# EAGLE design MinipHV2_1 (EAGLE 6.3)
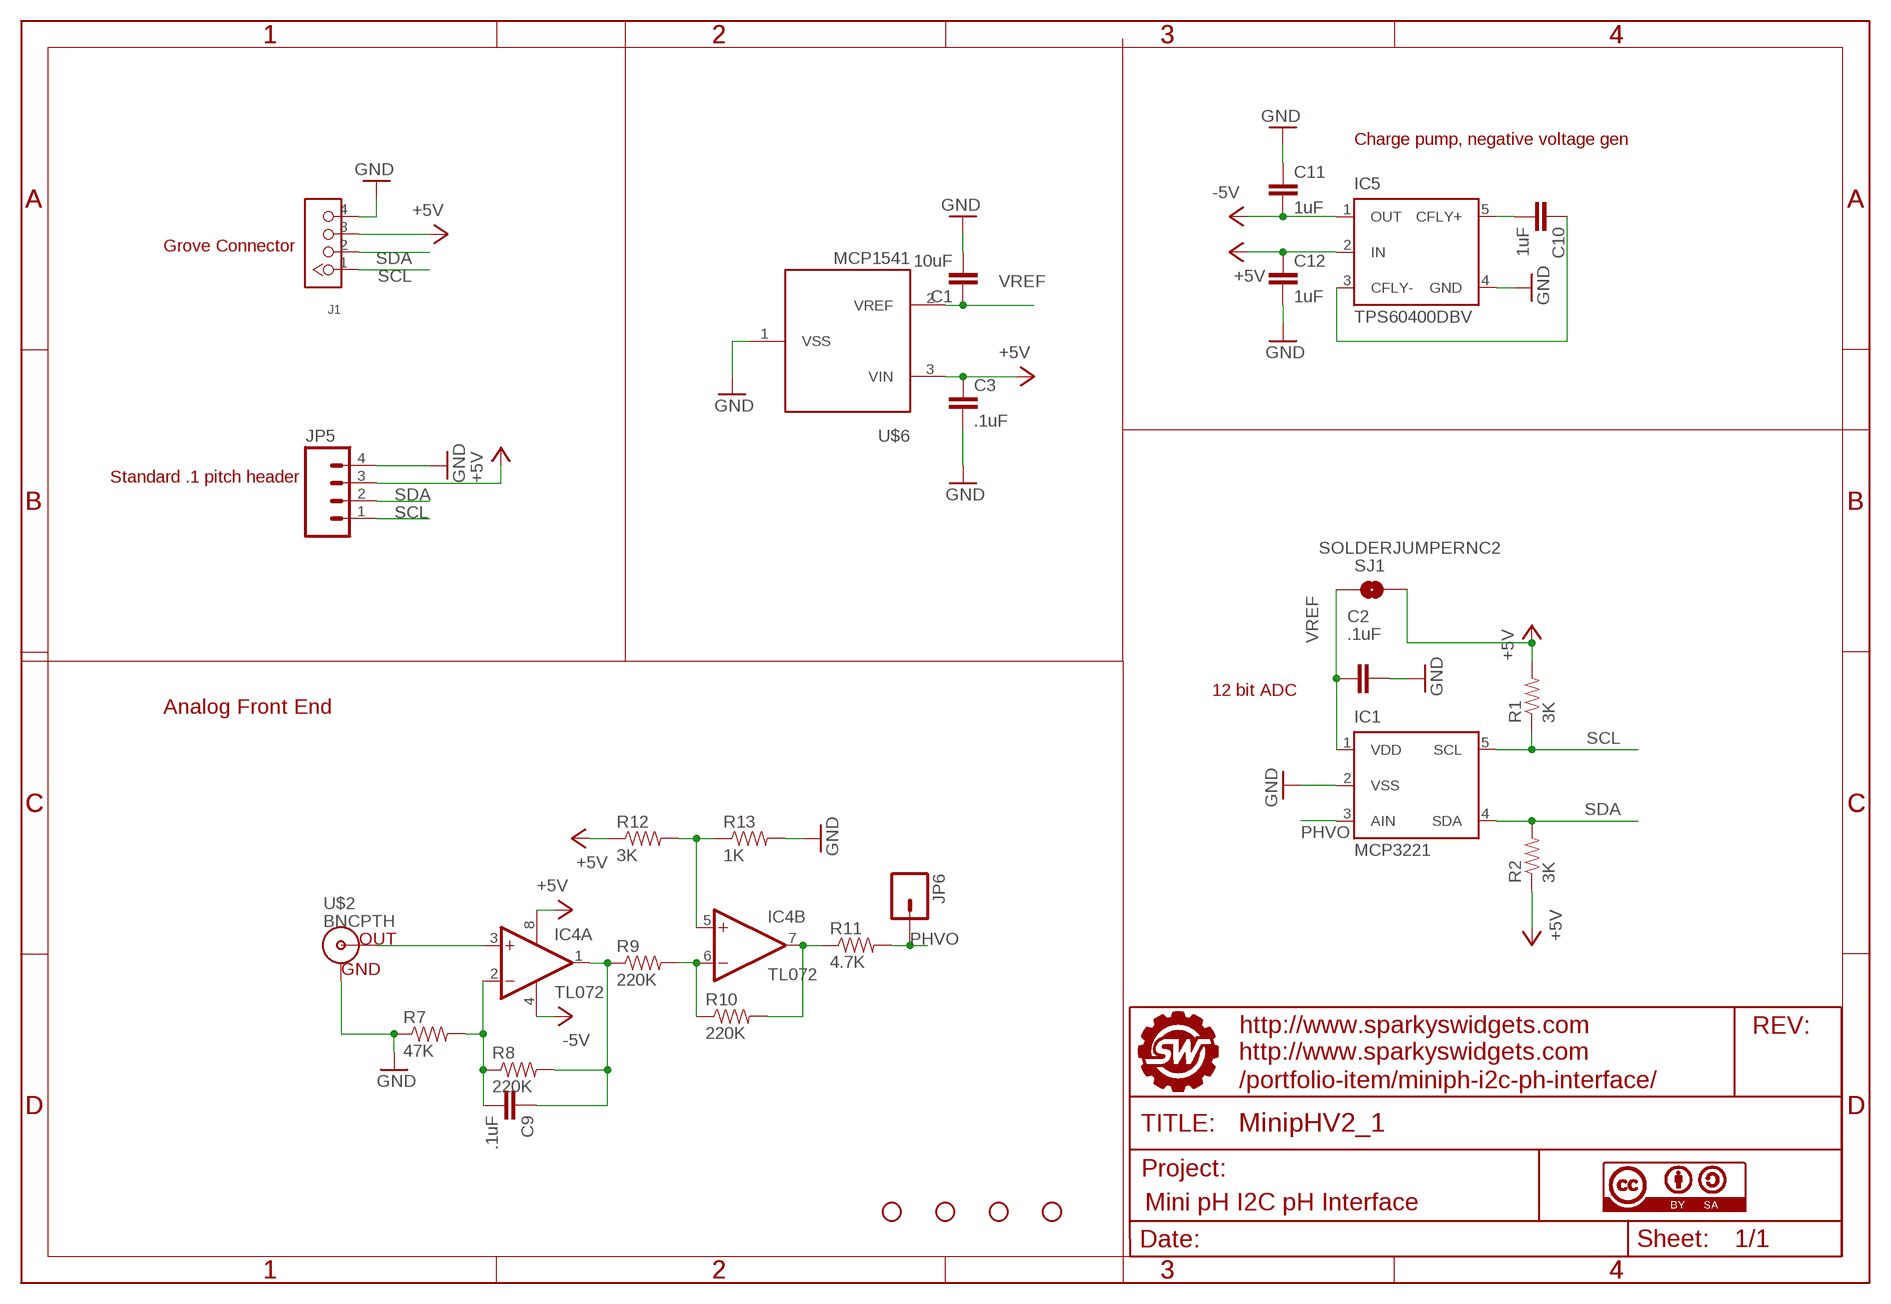
[diagram p0: schematic, sheet 1]

## Parts
C1  10uF  CAP0805  [0805]
C2  .1uF  CAP0805  [0805]
C3  .1uF  CAP0805  [0805]
C9  .1uF  CAP0805  [0805]
C10  1uF  CAP0805  [0805]
C11  1uF  CAP0805  [0805]
C12  1uF  CAP0805  [0805]
IC1  MCP3221  [SOT23-DBV]
IC4  TL072  LM358D  [SO08]
IC5  TPS60400DBV  [SOT23-DBV]
J1  TWIG-4P-2.0-2.0  [4P-2.0]
JP1  STAND-OFF  [STAND-OFF]
JP2  STAND-OFF  [STAND-OFF]
JP3  STAND-OFF  [STAND-OFF]
JP4  STAND-OFF  [STAND-OFF]
JP5  M04PTH  [1X04]
JP6  M01PTH_LONGPAD  [1X01_LONGPAD]
R1  3K  RESISTOR0805-RES  [0805]
R2  3K  RESISTOR0805-RES  [0805]
R7  47K  RESISTOR0805-RES  [0805]
R8  220K  RESISTOR0805-RES  [0805]
R9  220K  RESISTOR0805-RES  [0805]
R10  220K  RESISTOR0805-RES  [0805]
R11  4.7K  RESISTOR0805-RES  [0805]
R12  3K  RESISTOR0805-RES  [0805]
R13  1K  RESISTOR0805-RES  [0805]
SJ1  SOLDERJUMPERNC2  [SJ_2S-NOTRACE]
U$2  BNCPTH  [BNC]
U$4  FRAME_MINIPH  [SWPCBLOGOWITHINFO]
U$5  CC-BY-SA  [CC-BY-SA]
U$6  MCP1541  [SOT-23]

## Nets
+5V: C3.1 C12.1 IC4.8(P:V+) IC5.2(IN) J1.3 JP5.3 R1.2 R2.1 R12.1 SJ1.2 U$6.3(VIN)
-5V: C11.2 IC4.4(P:V-) IC5.1(OUT)
GND: C1.2 C2.1 C3.2 C11.1 C12.2 IC1.2(VSS) IC5.4(GND) J1.4 JP5.4 R7.1 R13.2 U$2.GND U$6.1(VSS)
N$1: IC4.5(B:+IN) R12.2 R13.1
N$2: IC4.7(B:OUT) R10.2 R11.1
N$3: IC4.6(B:-IN) R9.2 R10.1
N$7: IC4.3(A:+IN) U$2.S(OUT)
N$9: C9.2 IC4.2(A:-IN) R7.2 R8.1
N$10: C9.1 IC4.1(A:OUT) R8.2 R9.1
N$22: C10.1 IC5.3(CFLY-)
N$23: C10.2 IC5.5(CFLY+)
PHVO: IC1.3(AIN) JP6.1 R11.2
SCL: IC1.5(SCL) J1.1 JP5.1 R1.1
SDA: IC1.4(SDA) J1.2 JP5.2 R2.2
VREF: C1.1 C2.2 IC1.1(VDD) SJ1.1 U$6.2(VREF)

## Notes on the sheet
- Charge pump, negative voltage gen
- Grove Connector
- Standard .1 pitch header
- 12 bit ADC
- Analog Front End

## Library data of the parts
C1-C3 C9-C12 = SparkysWidgets:CAP: Capacitor Standard 0603 ceramic capacitor, and 0.1" leaded capacitor.
IC1 = SparkysWidgets:MCP3221: 12 bit I2C ADC Low power 12-bit I2c ADC from MicroChip upto 22.3KSPS Source: http://ww1.microchip.com/downloads/en/DeviceDoc/21732b.pdf
IC4 = SparkysWidgets:LM358: OP AMP also LM158; LM258; LM2904 Source: http://cache.national.com/ds/LM/LM158.pdf
IC5 = SparkysWidgets:TPS60400DBV: UNREGULATED CHARGE PUMP VOLTAGE INVERTER 60-mA unregultated charge pump voltage inverter Source: http://focus.ti.com/lit/ds/symlink/tps6040i.pdf
J1 = Connector:TWIG-4P-2.0
JP1-JP4 = SparkFun:STAND-OFF: Stand Off This is the mechanical footprint for a #4 phillips button head screw. Use the keepout ring to avoid running the screw head into surrounding components. SKU : PRT-00447
JP5 = SparkFun:M04: Header 4 Standard 4-pin 0.1" header. Use with straight break away headers (SKU : PRT-00116), right angle break away headers (PRT-00553), swiss pins (PRT-00743), machine pins (PRT-00117), and female headers (PRT-00115). Molex polarized connector foot print use with SKU : PRT-08231 with associated crimp pins and housings. 1MM SMD Version SKU: PRT-10208
JP6 = SparkFun:M01: Header 1 Standard 1-pin 0.1" header. Use with straight break away headers (SKU : PRT-00116), right angle break away headers (PRT-00553), swiss pins (PRT-00743), machine pins (PRT-00117), and female headers (PRT-00115).
R1 R2 R7-R13 = SparkysWidgets:RESISTOR: Resistor Basic schematic elements and footprints for 0603, 1206, and PTH resistors.
SJ1 = SparkFun:SOLDERJUMPER: Solder Jumper Standard SMD solder jumper. Used to automate production. Two varients : Normally Open and Normally Closed are the same, but have different paste layers. NC will have a large amount of paste and should jumper during reflow.
U$2 = SparkysWidgets:BNC: BNC Connector, Mouser Part# 5227161
U$4 = SparkysWidgets:FRAME_MINIPH: A4 Sparky's Widgets frame This is a standard A4 Frame, the Doc Field has been modified with our Logo and contains the license and extra project information!; PROJECT: Mini pH I2C pH Interface; URL1: /portfolio-item/miniph-i2c-ph-interface/; URLHOME: http://www.sparkyswidgets.com; URLPROJECT: http://www.sparkyswidgets.com
U$5 = SparkysWidgets:CC-BY-SA
U$6 = SparkysWidgets:MCP1541

## Board
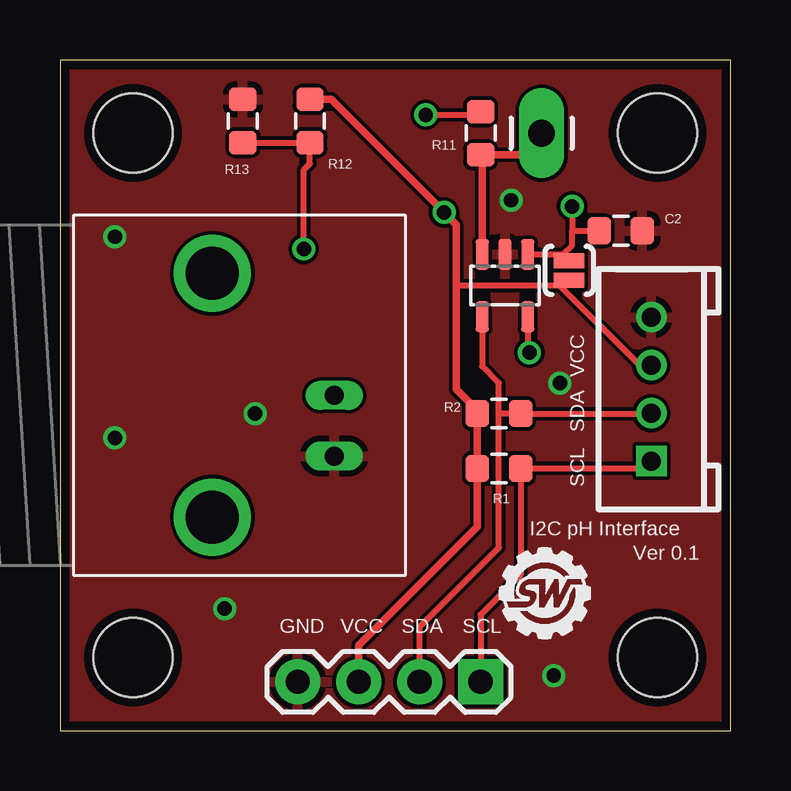
[diagram p1: board, top side]
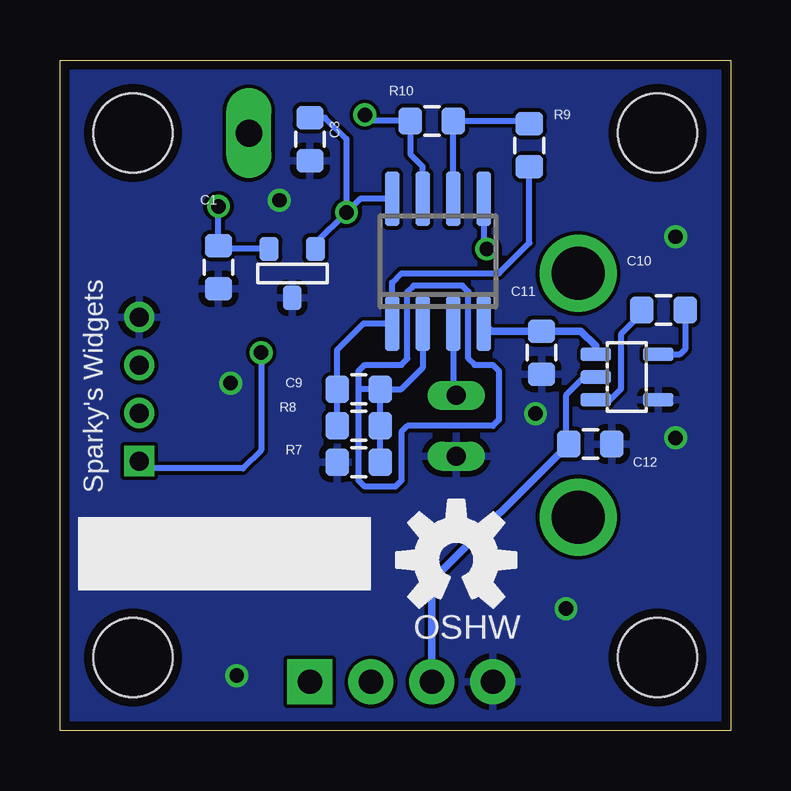
[diagram p2: board, bottom side, seen from below]

Size 27.94 x 27.94 mm. Coordinates in mm from the lower left corner, seen from the top.
Outline: 0,0 27.94,0 27.94,27.94 0,27.94 0,0
Copper layers (1*16): Top 0.0356mm / dielectric 1.5011mm / Bottom 0.0356mm
Design rules "LaenPCBOrder": minimum track width 6mil, minimum drill 13mil, track to track 6mil, track to pad 6mil, pad to pad 6mil, via to via 6mil, smd to smd 6mil, copper to edge 15mil, drill to drill 6mil, minimum pad ring 7mil, minimum via ring 7mil, stop-mask expansion 4mil, vias tented up to drill 0mil, thermal gap 10mil

### Footprints (pad centres in the part's own frame; a part is rotated, then mirrored left to right if it is on the bottom)
0805 = smd 0.984 x 1.143: 1 -0.9,0; 2 0.9,0
SOT23-DBV = smd 0.55 x 1.27: 1 -0.95,-1.3; 2 0,-1.3; 3 0.95,-1.3; 4 0.95,1.3; 5 -0.95,1.3
SO08 = smd 0.6 x 2.286: 1 -1.905,-2.6; 2 -0.635,-2.6; 3 0.635,-2.6; 4 1.905,-2.6; 5 1.905,2.6; 6 0.635,2.6; 7 -0.635,2.6; 8 -1.905,2.6
4P-2.0 = drill 0.8 pad 1.27 square: 1 -3,0 | drill 0.8 pad 1.27: 2 -1,0; 3 1,0; 4 3,0
STAND-OFF = hole 3.302: 0,0
1X04 = drill 1.016 pad 1.88 square: 1 0,0 | drill 1.016 pad 1.88: 2 2.54,0; 3 5.08,0; 4 7.62,0
1X01_LONGPAD = drill 1.118 pad 1.88 long: 1 0,0
SJ_2S-NOTRACE = smd 0.635 x 1.27: 1 -0.401,0; 2 0.413,0
BNC = drill 2.2: 3 -5.08,5.08; 4 5.08,5.08 | drill 0.8 long: GND -2.54,0; S 0,0
SOT-23 = smd 0.787 x 1.016: 1 0.025,-1.016; 2 -0.94,1.016; 3 0.991,1.016

### Placement (x,y rotation side)
C1  21.34,19.3 270 bottom
C2  23.37,20.83 180 top
C3  17.53,24.64 270 bottom
C9  15.49,14.22 0 bottom
C10  2.79,17.53 0 bottom
C11  7.87,15.75 90 bottom
C12  5.84,11.94 0 bottom
IC1  18.54,18.54 180 top
IC4  12.19,19.56 0 bottom
IC5  4.32,14.73 270 bottom
J1  24.64,14.22 90 top
JP1  3.05,3.05 0 top
JP2  24.89,3.05 0 top
JP3  3.05,24.89 0 top
JP4  24.89,24.89 0 top
JP5  17.53,2.03 180 top
JP6  20.07,24.89 0 top
R1  18.29,10.92 180 top
R2  18.29,13.21 0 top
R7  15.49,11.18 0 bottom
R8  15.49,12.7 180 bottom
R9  8.38,24.38 90 bottom
R10  12.45,25.4 180 bottom
R11  17.53,24.89 270 top
R12  10.41,25.4 270 top
R13  7.62,25.4 90 top
SJ1  21.21,19.18 270 top
U$1  [SWPCBLOGO]  18.29,3.81 0 top
U$2  11.43,13.97 90 top
U$3  [OSHW-LOGO-M]  11.43,7.11 0 bottom
U$4  -22.35,-5.33 0 top  (outside the outline)
U$5  -23.11,-11.94 0 top  (outside the outline)
U$6  18.29,19.05 0 bottom

### Tracks (layer width: path | path; a pad name or v marks a point on that pad's centre or on a via)
+5V  (via drill 0.6)
  Top 0.254: J1.3 24.15,15.22 20.83,18.54 | 20.83,18.54 16.51,18.54 | 20.83,18.54 20.99,18.54 SJ1.2
  Top 0.305: JP5.3 12.45,3.56 17.39,8.5 R1.2 R2.1 17.39,13.35 16.51,14.22 16.51,18.54 16.51,21.08 v16,21.59 11.29,26.3 R12.1
  Bottom 0.254: IC5.2 6.1,14.73 6.86,13.97 6.86,12.05 C12.1 | v16,21.59 16,24.64 16.9,25.54 C3.1 | U$6.3 17.3,20.3 v16,21.59 | IC4.8 15.43,22.16 v16,21.59
  Bottom 0.305: JP5.3 12.45,6.23 C12.1
-5V
  Bottom 0.305: IC5.1 5.62,16.03 6.23,16.65 C11.2 9.98,16.65 IC4.4
GND  (via drill 0.6)
  other vias: 8.13,13.21 2.29,20.57 2.29,12.19 6.86,5.08 20.57,2.29 20.83,14.48 18.8,22.1
  pour Top: -0.25,28.19 -0.25,-0.25 28.19,-0.25 28.19,28.19
  pour Bottom: -0.76,28.7 -0.76,-1.02 28.7,-0.76 28.7,28.7
N$1  (via drill 0.6)
  Top 0.254: R13.1 R12.2 10.41,23.62 10.16,23.37 v10.16,20.07
  Bottom 0.254: IC4.5 10.29,20.45 v10.16,20.07
N$2  (via drill 0.6)
  Top 0.254: v15.24,25.65 17.39,25.65 R11.1
  Bottom 0.254: IC4.7 12.83,23.5 13.35,24.01 R10.2 14.99,25.4 v15.24,25.65
N$3
  Bottom 0.254: R9.2 8.5,25.4 R10.1 11.56,25.39 IC4.6
N$7
  Bottom 0.254: IC4.3 11.56,14.1 U$2.S
N$9
  Bottom 0.254: IC4.2 12.83,15.11 13.72,14.22 C9.2 | 15.49,14.22 15.49,10.41 15.24,10.16 13.97,10.16 13.72,10.41 13.72,12.45 13.46,12.7 9.91,12.7 9.65,12.95 9.65,14.99 9.91,15.24 10.67,15.24 10.92,15.49 10.92,18.29 11.18,18.54 13.21,18.54 13.46,18.29 13.46,15.49 13.72,15.24 15.24,15.24 15.49,14.99 15.49,14.22 | R7.2 R8.1 C9.2 | C9.2 15.49,14.22
N$10
  Bottom 0.254: R9.1 8.38,20.32 9.65,19.05 13.72,19.05 14.1,18.67 IC4.1 15.3,16.96 16.39,15.86 C9.1 R8.2
N$22
  Bottom 0.254: C10.1 3.69,17.39 4.57,16.51 4.57,14.22 5.01,13.78 IC5.3
N$23
  Bottom 0.254: IC5.5 2.1,15.68 1.89,15.89 C10.2
PHVO
  Top 0.305: IC1.3 17.59,23.93 R11.2 19.17,23.99 JP6.1
SCL  (via drill 0.6)
  Top 0.254: J1.1 24.34,10.92 R1.1 19.19,6.49 17.53,4.83 JP5.1 | IC1.5 19.49,15.81 v19.56,15.75
  Bottom 0.254: v19.56,15.75 19.56,11.68 20.32,10.92 24.34,10.92 J1.1
SDA
  Top 0.254: JP5.2 14.99,4.32 18.29,7.62 18.29,13.21 | 18.29,13.21 18.29,14.48 17.59,15.17 IC1.4 | 18.29,13.21 R2.2 24.62,13.21 J1.2
VREF  (via drill 0.6)
  Top 0.254: IC1.1 20.97,19.84 | 20.97,19.84 C1.1 21.34,20.83 | 20.97,19.84 20.97,19.81 SJ1.1 | v21.34,21.84 21.34,20.83 | 21.34,20.83 C2.2
  Bottom 0.254: U$6.2 21.2,20.07 C1.1 v21.34,21.84

### Text on the board
tPlace: VCC | SDA | SCL | I2C pH Interface | Ver 0.1 | GND | VCC | SDA | SCL
bPlace: Sparky's Widgets | OSHW